# Altium schematic sheet USBHeaders.SchDoc
size A
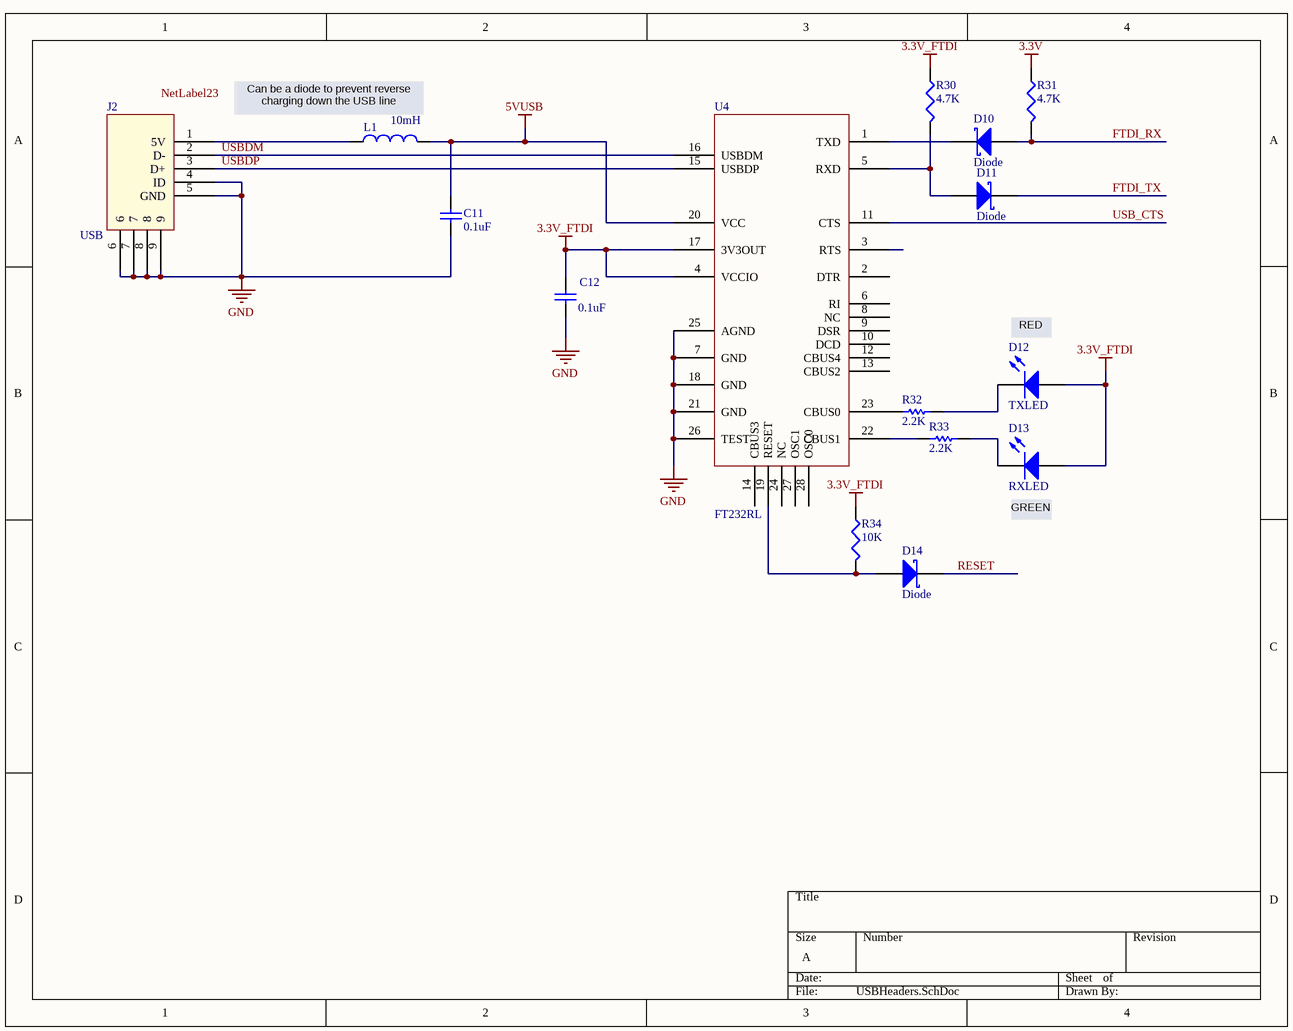
[diagram p0: USBHeaders.SchDoc]

## Parts
C11  value 0.1uF  [0402]
C12  value 0.1uF  [0402]
D10  Diode  [SurfaceMount(603)]
D11  Diode  [SurfaceMount(603)]
D12  TXLED  [SurfaceMount(603)]
D13  RXLED  [SurfaceMount(603)]
D14  Diode  [SurfaceMount(603)]
J2  USB  [USB Minib (thru-hole)]
L1  value 10mH  [2029]  (hidden comment: Inductor)
R30  value 4.7K  [J1-0603]  (hidden comment: Res3)
R31  value 4.7K  [J1-0603]  (hidden comment: Res3)
R32  value 2.2K  [J1-0603]
R33  value 2.2K  [J1-0603]
R34  value 10K  [J1-0603]  (hidden comment: Res3)
U4  FT232RL  [SSOP-28]

## Nets
3.3V: R31.1
3.3V_FTDI: C12.2 D12.1(A) D13.1(A) R30.1 R34.1 U4.4(VCCIO) U4.17(3V3OUT)
5VUSB: C11.2 L1.2 U4.20(VCC)
GND: C11.1 C12.1 J2.4(ID) J2.5(GND) J2.6 J2.7 J2.8 J2.9 U4.7(GND) U4.18(GND) U4.21(GND) U4.25(AGND) U4.26(TEST)
FTDI_RX: D10.2(A) R31.2
FTDI_TX: D11.1(K)
RESET: D14.1(K)
USB_CTS: U4.11(CTS)
USBDM: J2.2(D-) U4.16(USBDM)
USBDP: J2.3(D+) U4.15(USBDP)
NetD10_1: D10.1(K) U4.1(TXD)
NetD11_2: D11.2(A) R30.2 U4.5(RXD)
NetD12_2: D12.2(K) R32.2
NetD13_2: D13.2(K) R33.2
NetD14_2: D14.2(A) R34.2 U4.19(RESET)
NetJ2_1: J2.1(5V) L1.1
NetR32_1: R32.1 U4.23(CBUS0)
NetR33_1: R33.1 U4.22(CBUS1)

Not connected (* = marked no-connect by the designer): U4 2(DTR) 3(RTS) 6(RI) 8(NC) 9(DSR) 10(DCD) 12(CBUS4) 13(CBUS2) 14(CBUS3) 24(NC) 27(OSC1) 28(OSC0)

## Notes on the sheet
- (near L1) Can be a diode to prevent reverse charging down the USB line
- (near D12) RED
- (near D13) GREEN
- Labels drawn without touching a wire or pin: NetLabel23

## Library data of the parts
C11 C12 = Cap: Capacitor; Published: 8-Jun-2000; LatestRevisionDate: 17-Jul-2002; LatestRevisionNote: Re-released for DXP Platform.; PackageReference: RAD-0.3; Publisher: Altium Limited
D10 D11 D14 = SchottkeyDiode
D12 D13 = LED2: Typical RED, GREEN, YELLOW, AMBER GaAs LED; Published: 8-Jun-2000; LatestRevisionDate: 17-Jul-2002; LatestRevisionNote: Re-released for DXP Platform.; PackageVersion: Feb-2002; PackageReference: 3.2X1.6X1.1; Publisher: Altium Limited
J2 = USB-ConnTH
L1 = Inductor: Code_IEC: 1005; Published: 8-Jun-2000; LatestRevisionDate: 29-May-2009; LatestRevisionNote: IPC-7351 Footprint Added.; PackageReference: 0402-A; Publisher: Altium Limited; PackageDescription: Chip Inductor; Code_JEITA: 0402
R30 R31 R34 = Res3: Resistor; Published: 8-Jun-2000; LatestRevisionDate: 29-May-2009; LatestRevisionNote: IPC-7351 Footprint Added.; PackageReference: J1-0603; Publisher: Altium Limited; PackageDescription: Chip Resistor
R32 R33 = Res1: Resistor; Published: 8-Jun-2000; LatestRevisionDate: 17-Jul-2002; LatestRevisionNote: Re-released for DXP Platform.; PackageReference: AXIAL-0.3; Publisher: Altium Limited